# EAGLE design kitchenClock_v4 (EAGLE 6.1)
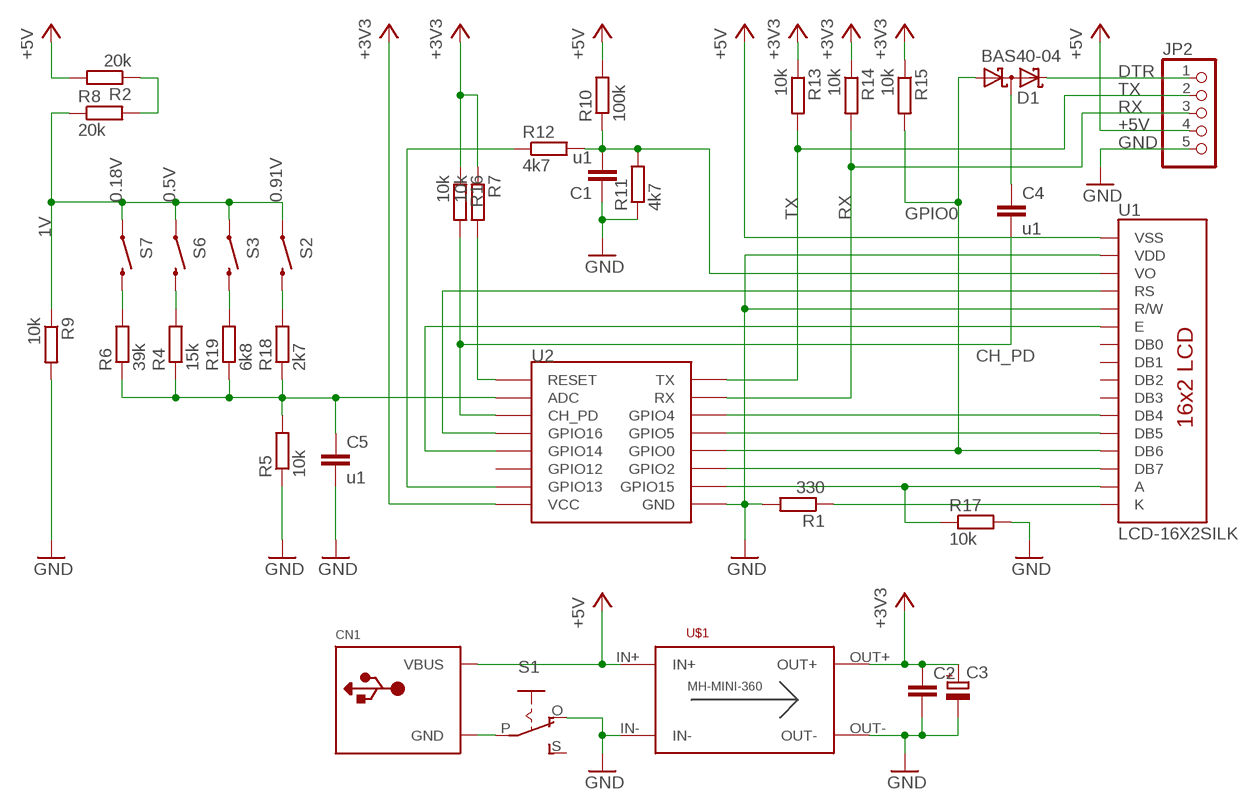
[diagram p0: schematic, sheet 1]

## Parts
C1  u1  C-EU075-032X103  [C075-032X103]
C2  C-EU025-025X050  [C025-025X050]
C3  CPOL-EUTT2D5L  [TT2D5L]
C4  u1  C-EU075-032X103  [C075-032X103]
C5  u1  C-EU025-025X050  [C025-025X050]
CN1  USBPWR-ONLY  [USB-MINIB-THM]
D1  BAS40-04  [SOT23]
JP2  PINHD-1X5/90  [1X05/90]
R1  330  R-EU_M0805  [M0805]
R2  20k  R-EU_0204/7  [0204/7]
R4  15k  R-EU_0204/7  [0204/7]
R5  10k  R-EU_0204/7  [0204/7]
R6  39k  R-EU_0204/7  [0204/7]
R7  10k  R-EU_0204/7  [0204/7]
R8  20k  R-EU_0204/7  [0204/7]
R9  10k  R-EU_0204/7  [0204/7]
R10  100k  R-EU_M0805  [M0805]
R11  4k7  R-EU_0204/7  [0204/7]
R12  4k7  R-EU_0207/10  [0207/10]
R13  10k  R-EU_0207/10  [0207/10]
R14  10k  R-EU_0207/10  [0207/10]
R15  10k  R-EU_0207/10  [0207/10]
R16  10k  R-EU_M0805  [M0805]
R17  10k  R-EU_M0805  [M0805]
R18  2k7  R-EU_0204/7  [0204/7]
R19  6k8  R-EU_0204/7  [0204/7]
S1  EG1218S  [EG1218]
S2  SWITCH-MOMENTARY-2PTH  [TACTILE-PTH]
S3  SWITCH-MOMENTARY-2PTH  [TACTILE-PTH]
S6  SWITCH-MOMENTARY-2PTH  [TACTILE-PTH]
S7  SWITCH-MOMENTARY-2PTH  [TACTILE-PTH]
U1  LCD-16X2SILK  [LCD-16X2]
U2  ESP12EDIP  [ESP-12-BREAKOUT]
U$1  DC-DC_CONV_MINISTD  [DC-DC_CONV_MINI]

## Nets
1V: R8.1 R9.1 S2.1 S3.1 S6.1 S7.1
+3V3: C2.1 C3.+ R7.1 R13.1 R14.1 R15.1 R16.1 U2.P$1(VCC) U$1.OUT+
+5V: CN1.VBUS JP2.4 R2.2 R10.2 U1.1(VSS) U$1.IN+
CH_PD: C4.2 R16.2 U2.P$6(CH_PD)
DTR: D1.2(C2) JP2.1
GND: C1.1 C2.2 C3.- C5.2 JP2.5 R1.2 R5.1 R9.2 R11.1 R17.2 S1.O U1.2(VDD) U1.5(R/W) U2.P$9(GND) U$1.IN- U$1.OUT-
GPIO0: D1.1(A1) R15.2 U1.13(DB6) U2.P$12(GPIO0)
N$1: R1.1 U1.16(K)
N$2: R12.1 U2.P$2(GPIO13)
N$3: U1.4(RS) U2.P$5(GPIO16)
N$4: U1.6(E) U2.P$4(GPIO14)
N$5: U1.11(DB4) U2.P$14(GPIO4)
N$6: U1.12(DB5) U2.P$13(GPIO5)
N$8: U1.14(DB7) U2.P$11(GPIO2)
N$9: R17.1 U1.15(A) U2.P$10(GPIO15)
N$10: C5.1 R4.1 R5.2 R6.1 R18.1 R19.1 U2.P$7(ADC)
N$11: R4.2 S6.3
N$12: CN1.GND CN1.GND1(GND) CN1.GND2(GND) CN1.GND3(GND) CN1.GND4(GND) S1.P
N$13: R6.2 S7.3
N$14: R7.2 U2.P$8(RESET)
N$15: R2.1 R8.2
N$16: R18.2 S2.3
N$17: R19.2 S3.3
N$18: C4.1 D1.3(C1A2)
N$19: C1.2 R10.1 R11.2 R12.2 U1.3(VO)
RX: JP2.3 R14.2 U2.P$15(RX)
TX: JP2.2 R13.2 U2.P$16(TX)
Unconnected: S1.S U1.7(DB0) U1.8(DB1) U1.9(DB2) U1.10(DB3) U2.P$3(GPIO12)

## Notes on the sheet
- 0.18V | 0.5V | 0.91V

## Library data of the parts
C1 C2 C4 C5 = rcl:C-EU: CAPACITOR, European symbol
C3 = rcl:CPOL-EU: POLARIZED CAPACITOR, European symbol
CN1 = _MY_OWN_LIB:USB: USB Connectors USBMINIB - Surface Mount Female Mini-B USB Connector 4UConnector: 06564 By microbuilder.eu Thru-hole RA Female Mini-B USB Connector 4UConnector: 18732 By ladyada.net
D1 = diode:BAS40-04: Silicon Schottky Diodes General-purpose diode for high-speed switching
JP2 = pinhead:PINHD-1X5: PIN HEADER
R1 R2 R4-R19 = rcl:R-EU_: RESISTOR, European symbol
S1 = _MY_OWN_LIB:EG1218: SLIDING SWITCH 0.1" spacing through hole, vertical SPDT slide switch http://www.ladyada.net/library/pcb/eaglelibrary.html
S2 S3 S6 S7 = SparkFun-Electromechanical:SWITCH-MOMENTARY-2: Various NO switches- pushbuttons, reed, etc
U1 = SparkFun-Displays:LCD-16X2: Standard text-only 16x2 parallel input LCD
U2 = _MY_OWN_LIB:ESP12E: ESP12E Module
U$1 = _MY_OWN_LIB:DC-DC_CONV_MINI

## Board
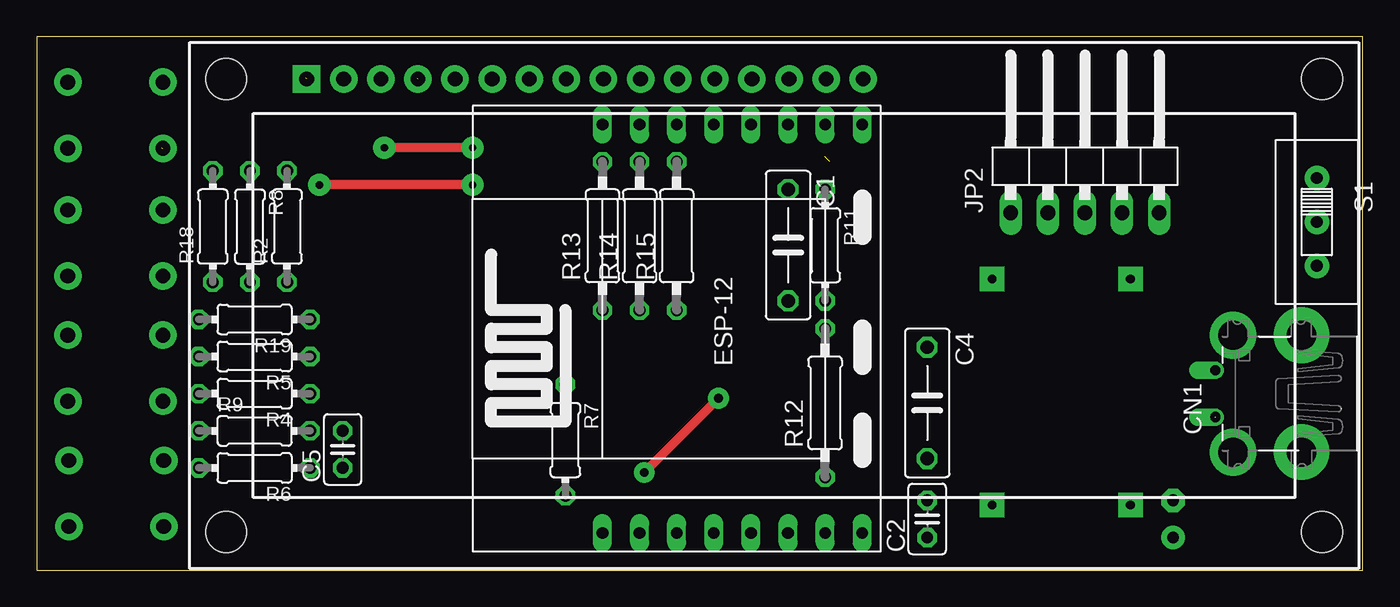
[diagram p1: board, top side]
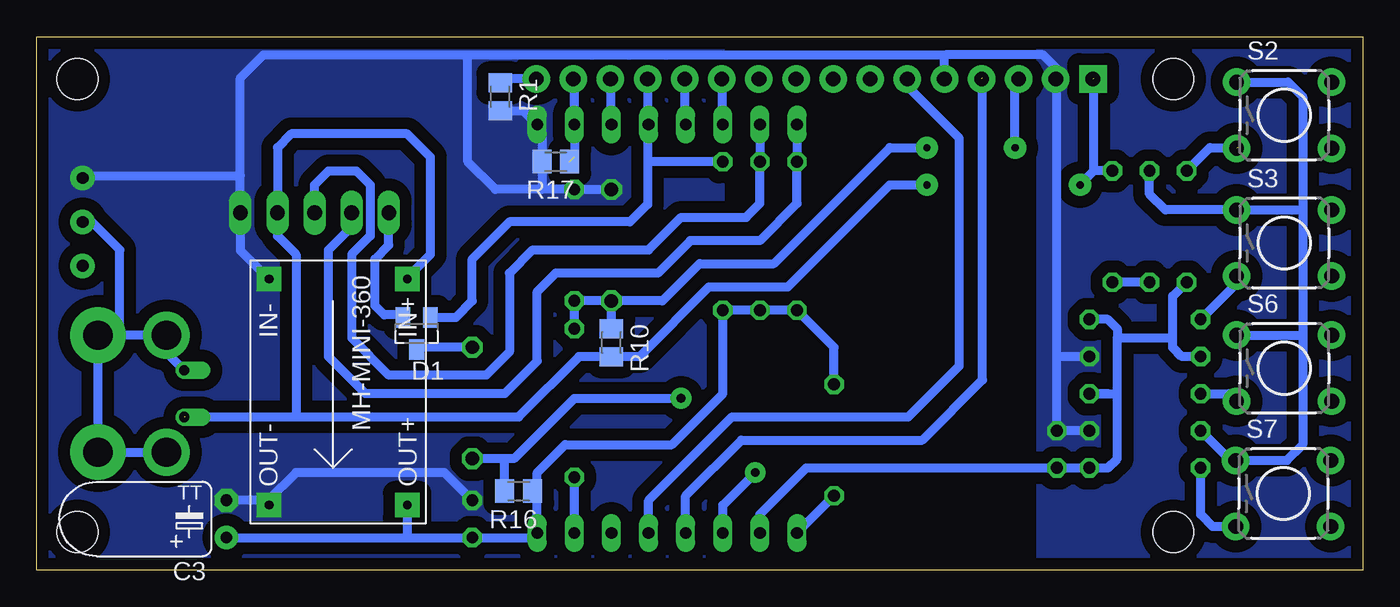
[diagram p2: board, bottom side, seen from below]

Size 90.78 x 36.5 mm. Coordinates in mm from the lower left corner, seen from the top.
Outline: 0,0 90.78,0 90.78,36.5 0,36.5 0,0
Copper layers (1*16): Top 0.035mm / dielectric 1.5mm / Bottom 0.035mm
Design rules: minimum track width 10mil, minimum drill 24mil, track to track 12mil, track to pad 12mil, pad to pad 12mil, via to via 12mil, smd to smd 10mil, copper to edge 12mil, drill to drill 12mil, minimum pad ring 10mil, minimum via ring 10mil, stop-mask expansion 4mil, vias tented up to drill 0mil, thermal gap 12mil

### Footprints (pad centres in the part's own frame; a part is rotated, then mirrored left to right if it is on the bottom)
C075-032X103 = drill 0.914 octagon: 1 -3.81,0; 2 3.81,0
C025-025X050 = drill 0.813 octagon: 1 -1.27,0; 2 1.27,0
TT2D5L = drill 0.813 pad 1.6: + -1.27,0 | drill 0.813 pad 1.6 octagon: - 1.27,0
USB-MINIB-THM = drill 0.7 offset: GND 1.6,9.8; VBUS -1.6,9.8 | drill 2 pad 3.81: GND1 -4,3.9; GND4 4,3.9 | drill 2 pad 3.2: GND2 -4,8.6; GND3 4,8.6
SOT23 = smd 1 x 1.4: 1 -0.95,-1.1; 2 0.95,-1.1; 3 0,1.1
1X05/90 = drill 1.016 long: 1 -5.08,-3.81; 2 -2.54,-3.81; 3 0,-3.81; 4 2.54,-3.81; 5 5.08,-3.81
M0805 = smd 1.3 x 1.6: 1 -0.95,0; 2 0.95,0
0204/7 = drill 0.813 octagon: 1 -3.81,0; 2 3.81,0
0207/10 = drill 0.813 octagon: 1 -5.08,0; 2 5.08,0
EG1218 = drill 0.8 pad 1.676: O -3,0; P 0,0; S 3,0
TACTILE-PTH = drill 1.016 pad 1.88: 1 -3.251,2.261; 2 3.251,2.261; 3 -3.251,-2.261; 4 3.251,-2.261
LCD-16X2 = drill 1.016 pad 1.88 square: 1 -32,15.5 | drill 1.016 pad 1.88: 2 -29.46,15.5; 3 -26.92,15.5; 4 -24.38,15.5; 5 -21.84,15.5; 6 -19.3,15.5; 7 -16.76,15.5; 8 -14.22,15.5; 9 -11.68,15.5; 10 -9.14,15.5; 11 -6.6,15.5; 12 -4.06,15.5; 13 -1.52,15.5; 14 1.02,15.5; 15 3.56,15.5; 16 6.1,15.5 | hole 2.8: -37.5,15.5; -37.5,-15.5; 37.5,15.5; 37.5,-15.5
ESP-12-BREAKOUT = drill 0.8 long: P$1 0,0; P$2 0,2.54; P$3 0,5.08; P$4 0,7.62; P$5 0,10.16; P$6 0,12.7; P$7 0,15.24; P$8 0,17.78; P$9 27.94,0; P$10 27.94,2.54; P$11 27.94,5.08; P$12 27.94,7.62; P$13 27.94,10.16; P$14 27.94,12.7; P$15 27.94,15.24; P$16 27.94,17.78
DC-DC_CONV_MINI = drill 0.6 pad 1.676 square: IN+ 16.73,1.27; IN- 16.73,10.73; OUT+ 1.27,1.27; OUT- 1.27,10.73

### Placement (x,y rotation side)
C1  51.44,22.23 270 top
C2  60.96,3.49 90 top
C3  77.79,3.49 90 bottom
C4  60.96,11.43 270 top
C5  20.95,8.26 90 top
CN1  90.49,12.06 90 top
D1  64.77,16.19 180 bottom
JP2  71.75,28.26 0 top
R1  59.05,32.38 270 bottom
R2  17.15,23.5 90 top
R4  14.92,12.06 180 top
R5  14.92,14.61 180 top
R6  14.92,6.99 180 top
R7  36.2,8.89 270 top
R8  14.6,23.5 270 top
R9  14.92,9.53 0 top
R10  51.44,15.56 270 bottom
R11  53.98,22.23 270 top
R12  53.98,11.43 90 top
R13  38.73,22.86 90 top
R14  41.27,22.86 90 top
R15  43.81,22.86 90 top
R16  57.78,5.4 180 bottom
R17  55.24,27.94 180 bottom
R18  12.06,23.5 90 top
R19  14.92,17.14 180 top
S1  87.63,23.81 270 top
S2  5.4,31.11 0 bottom
S3  5.4,22.38 0 bottom
S6  5.4,13.81 0 bottom
S7  5.46,5.24 0 bottom
U1  50.48,18.1 0 top
U2  56.52,2.54 90 top
U$1  64.14,3.17 90 bottom

### Tracks (layer width: path | path; a pad name or v marks a point on that pad's centre or on a via)
1V
  Bottom 0.61: S2.1 5.12,33.38 4.13,32.38 4.13,24.45 | 4.13,24.45 4.13,15.88 | 4.13,15.88 4.13,8.57 5.2,7.5 S7.1 9.09,7.5 R9.1 | S6.1 4.32,16.07 4.13,15.88 | 4.13,24.45 4.32,24.64 S3.1 13.52,24.64 14.6,25.72 R8.1
+3V3
  Bottom 0.61: C3.+ 65.4,2.22 | 65.4,2.22 C2.1 56.83,2.22 U2.P$1 56.51,5.4 | 56.51,5.4 56.51,6.67 54.61,8.57 47.31,8.57 43.81,12.06 R15.1 R14.1 R13.1 36.2,15.24 R7.1 | R16.1 56.51,5.4 | U$1.OUT+ 65.4,2.22
+5V  (via drill 0.5 pad 1.52)  (2 unrouted)
  Top 0.61: v29.84,26.35 v19.37,26.35
  Bottom 0.61: 80.64,10.48 73.02,10.48 | 73.02,10.48 57.79,10.48 53.66,14.61 R10.2 | R10.2 49.53,14.61 44.77,19.37 39.37,19.37 32.38,26.35 v29.84,26.35 | R10.2 | U$1.IN+ 65.4,20 63.82,21.59 63.82,28.26 65.4,29.84 73.34,29.84 74.29,28.89 JP2.4 74.29,22.86 73.02,21.59 73.02,10.48 | 18.41,27.3 18.41,33.66 | R2.2 18.41,27.3 | 18.41,27.3 v19.37,26.35
CH_PD  (via drill 0.6 pad 1.42)
  Top 0.61: v41.59,6.67 v46.67,11.75
  Bottom 0.61: U2.P$6 43.81,4.45 v41.59,6.67 | 58.74,7.62 58.1,7.62 53.97,11.75 v46.67,11.75 | 58.74,7.62 C4.2 | R16.2 58.73,7.62 58.74,7.62
DTR
  Bottom 0.61: D1.2 65.72,17.46 66.99,17.46 67.63,18.1 67.63,21.27 66.67,22.23 JP2.1
GND
  Bottom 0.61: 28.57,35.24 21.91,35.24 20.95,34.29 20.95,33.66 | U1.5 28.64,35.17 28.57,35.24 | 61.28,35.24 75.25,35.24 76.84,33.66 76.84,26.99 | 61.28,35.24 28.57,35.24 | S1.O 87.63,26.99 76.84,26.99 | 76.84,26.99 JP2.5 76.84,21.88 U$1.IN- | C1.1 R11.1 56.2,26.04 | C2.2 62.87,6.67 73.02,6.67 74.93,4.76 | 74.93,4.76 C3.- | U$1.OUT- 74.86,4.7 74.93,4.76 | 56.2,26.04 59.37,26.04 61.28,27.94 61.28,35.24 | R1.2 57.47,31.43 U2.P$9 56.2,30.16 56.2,26.04 | 20.95,14.61 C5.2 R9.2 | 20.95,14.61 20.95,33.66 | U1.2 20.95,33.66 | R5.1 20.95,14.61
  pour Bottom (isolate 0.813, no thermals): 43.81,0 90.81,0 90.81,36.51 43.81,36.51
  pour Bottom (isolate 0.813, no thermals): 0,-0.32 22.23,-0.32 22.23,36.51 0,36.51
GPIO0
  Bottom 0.61: U1.13 48.96,30.48 | U2.P$12 48.96,30.48 | 48.96,30.48 48.96,27.94 | 48.96,27.94 48.96,25.02 50.16,23.81 58.42,23.81 60.96,21.27 60.96,18.41 62.08,17.29 D1.1 | R15.2 48.96,27.94
N$1
  Bottom 0.61: U1.16 58.79,33.6 R1.1
N$2
  Bottom 0.61: U2.P$2 R12.1
N$3  (1 unrouted)
  Bottom 0.61: U2.P$5 46.35,5.08 42.55,8.89 30.16,8.89 26.04,13.02 26.04,33.66
N$4
  Bottom 0.61: U2.P$4 48.89,4.76 43.18,10.48 31.11,10.48 27.62,13.97 27.62,29.53 31.18,33.09 U1.6
N$5
  Bottom 0.61: U1.11 43.88,30.55 U2.P$14
N$6
  Bottom 0.61: U1.12 46.42,30.55 U2.P$13
N$8
  Bottom 0.61: U1.14 51.5,30.55 U2.P$11
N$9  (1 unrouted)
  Bottom 0.61: 53.97,28.26 U2.P$10 53.97,33.53 U1.15
N$10
  Bottom 0.61: U2.P$7 41.28,3.81 38.1,6.99 C5.1 R6.1 17.46,6.99 16.83,7.62 16.83,12.06 | 17.46,12.06 R4.1 16.83,12.06 | 13.02,15.88 13.02,15.24 12.38,14.61 R5.2 | 13.02,15.88 13.02,18.73 R18.1 | 16.83,12.06 16.83,15.88 | R19.1 17.46,17.14 16.83,16.51 16.83,15.88 | 16.83,15.88 13.02,15.88
N$11
  Bottom 0.61: R4.2 9.17,12.06 S6.3
N$12
  Bottom 0.61: CN1.GND4 CN1.GND1 CN1.GND2 | CN1.GND 81.89,14.87 CN1.GND3 CN1.GND4 | CN1.GND4 85.22,16.07 85.09,16.19 85.09,21.91 86.99,23.81 S1.P
N$13
  Bottom 0.61: S7.3 10.28,2.98 11.11,3.81 R6.2
N$14
  Bottom 0.61: U2.P$8 R7.2
N$15
  Bottom 0.61: R8.2 R2.1
N$16  (1 unrouted)
  Bottom 0.61: R18.2 10.48,28.89 8.57,28.89
N$17
  Bottom 0.61: S3.3 8.65,19.61 R19.2
N$18
  Bottom 0.61: C4.1 64.62,15.24 D1.3
N$19  (via drill 0.5 pad 1.52)
  Top 0.61: v29.84,28.89 v23.81,28.89
  Bottom 0.61: v23.81,28.89 23.81,33.35 U1.3 | C1.2 47.94,18.41 45.4,20.95 40.32,20.95 32.38,28.89 v29.84,28.89 | C1.2 R11.2 R12.2 | R10.1 C1.2
RX
  Bottom 0.61: U2.P$15 R14.2 41.28,25.08 42.23,24.13 46.67,24.13 48.89,21.91 56.83,21.91 58.42,20.32 58.42,14.92 60.01,13.34 66.67,13.34 69.22,15.88 69.22,21.59 67.95,22.86 67.95,26.35 68.9,27.3 70.8,27.3 71.75,26.35 JP2.3
TX
  Bottom 0.61: U2.P$16 R13.2 38.73,25.08 41.28,22.54 46.04,22.54 48.26,20.32 55.25,20.32 56.51,19.05 56.51,14.29 58.74,12.06 68.26,12.06 70.8,14.61 70.8,21.91 69.22,23.5 JP2.2